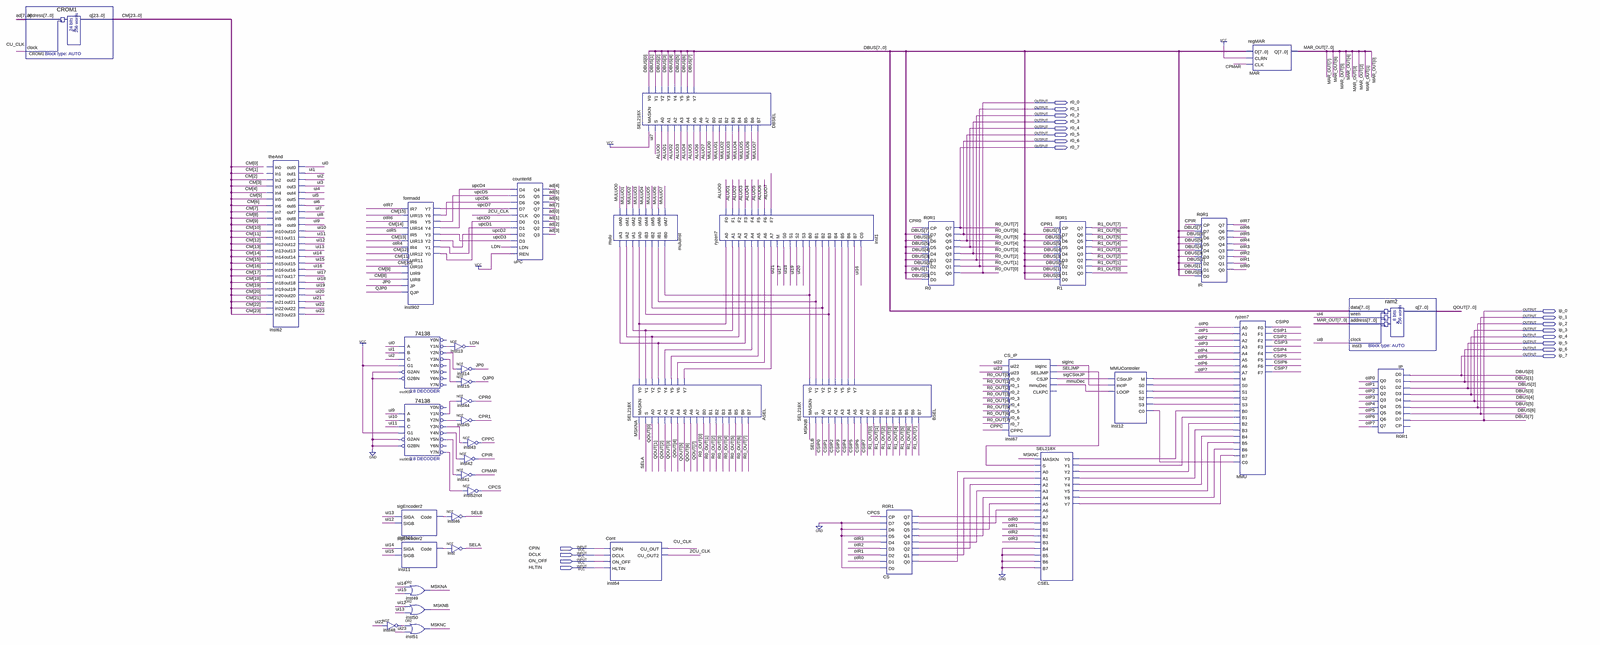
[diagram p0: schematic sheet, whole]
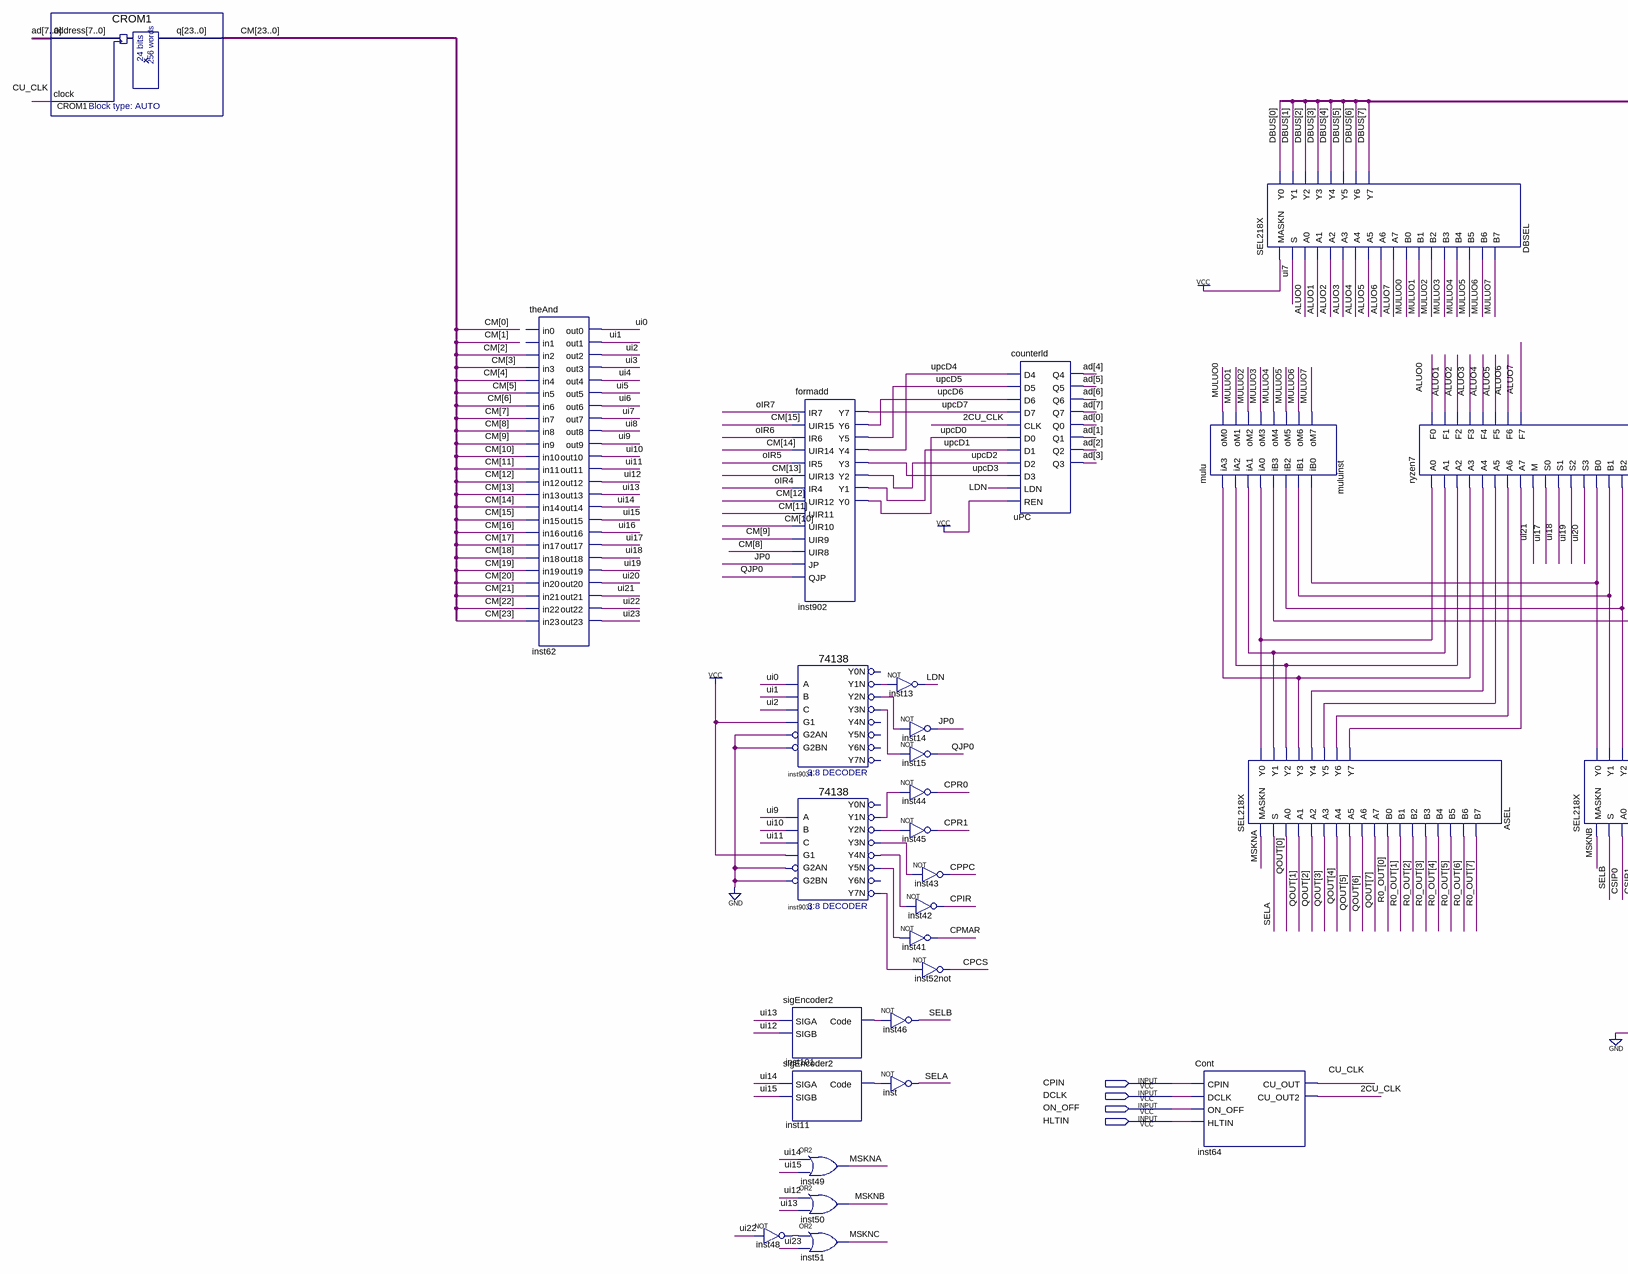
[diagram p1: schematic sheet, left part]
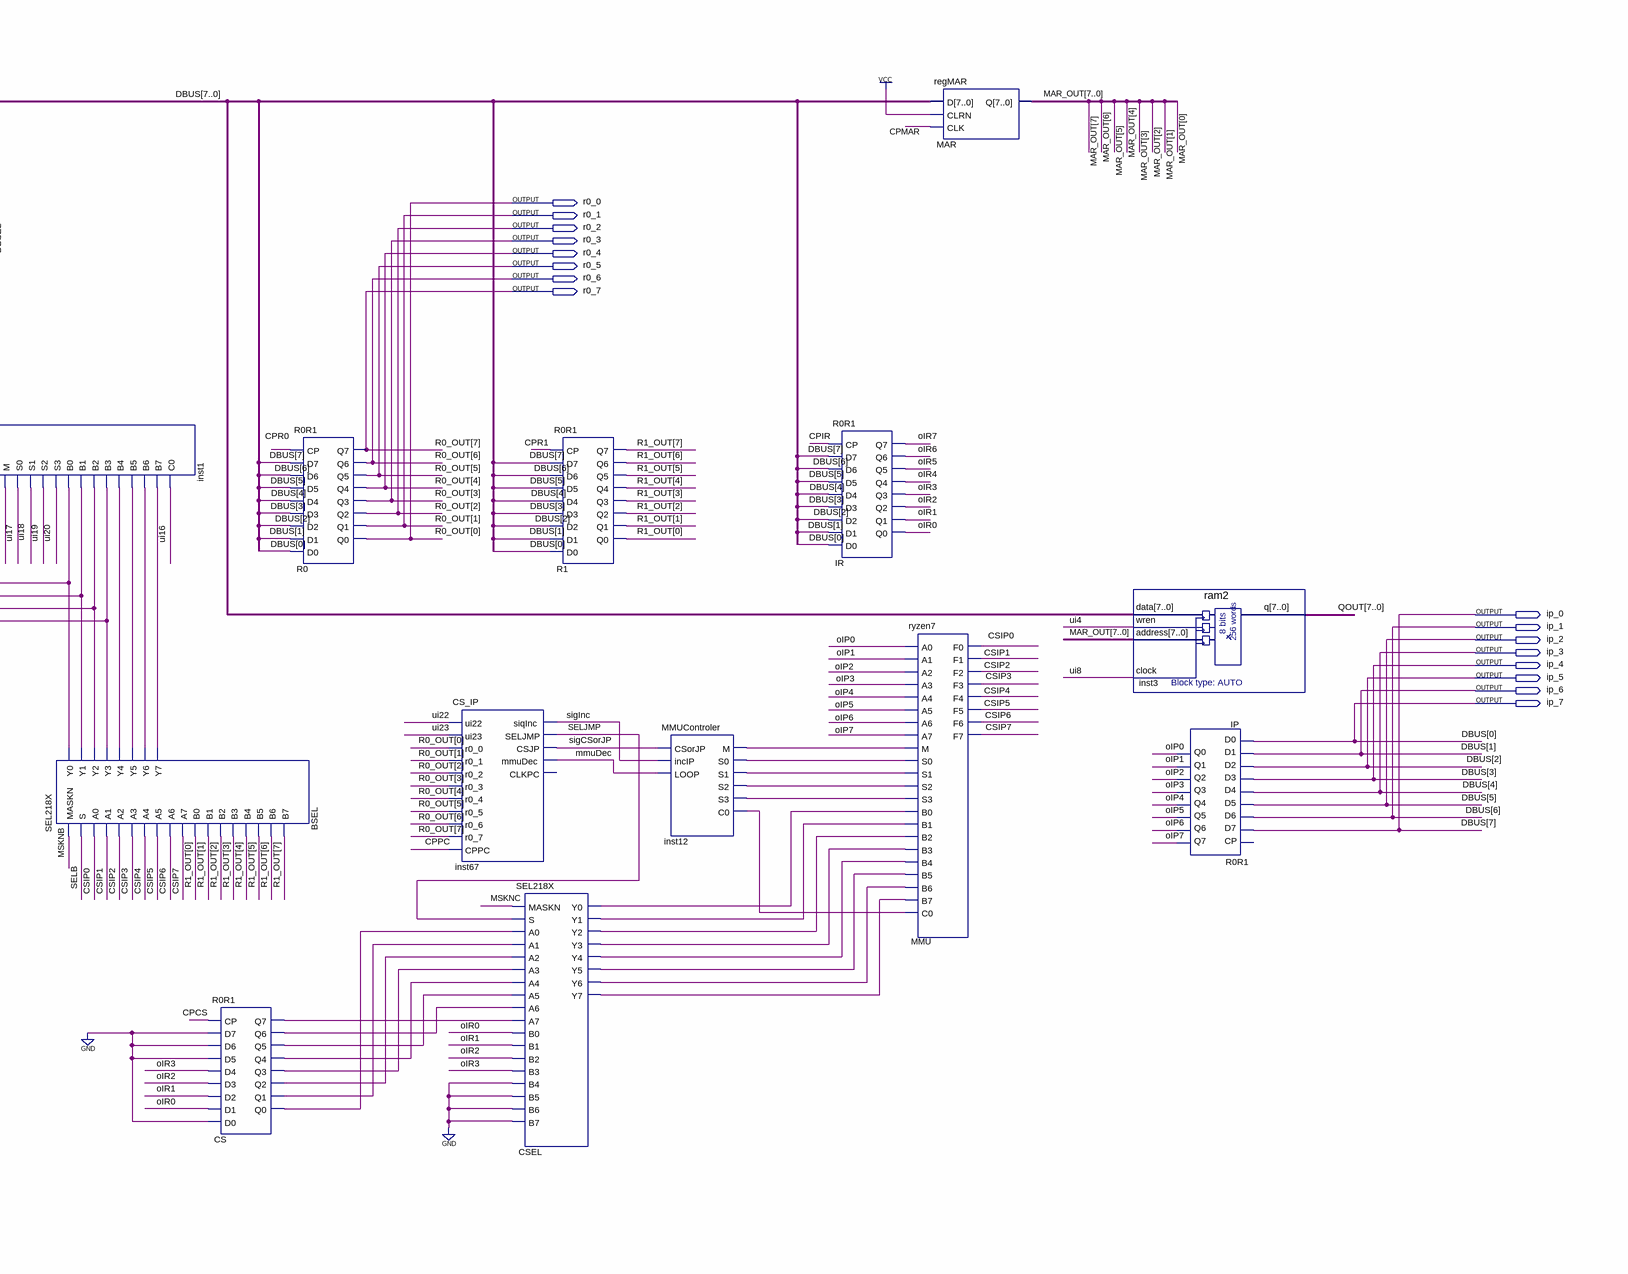
[diagram p2: schematic sheet, right part]
// Quartus schematic proj3_t1.bdf as structural Verilog: 40 symbols, 20 pins
module proj3_t1 (
  input  CPIN,
  input  DCLK,
  input  ON_OFF,
  input  HLTIN,
  output r0_0,
  output r0_1,
  output r0_2,
  output r0_3,
  output r0_4,
  output r0_5,
  output r0_6,
  output r0_7,
  output ip_0,
  output ip_1,
  output ip_2,
  output ip_3,
  output ip_4,
  output ip_5,
  output ip_6,
  output ip_7
);

  wire \2CU_CLK , ALUO0, ALUO1, ALUO2, ALUO3, ALUO4, ALUO5, ALUO6, ALUO7, ASEL_y0, ASEL_y1, ASEL_y2, ASEL_y3,
       ASEL_y4, ASEL_y5, ASEL_y6, ASEL_y7, BSEL_y0, BSEL_y1, BSEL_y2, BSEL_y3, BSEL_y4, BSEL_y5, BSEL_y6,
       BSEL_y7, CPCS, CPIR, CPMAR, CPPC, CPR0, CPR1, CS_q0, CS_q1, CS_q2, CS_q3, CS_q4, CS_q5, CS_q6, CS_q7,
       CSEL_y0, CSEL_y1, CSEL_y2, CSEL_y3, CSEL_y4, CSEL_y5, CSEL_y6, CSEL_y7, CSIP0, CSIP1, CSIP2, CSIP3,
       CSIP4, CSIP5, CSIP6, CSIP7, CU_CLK, inst11_code, inst12_c0, inst12_m, inst12_s0, inst12_s1, inst12_s2,
       inst12_s3, inst48_out, inst101_code, inst9031_y1n, inst9031_y2n, inst9031_y3n, inst9031_y4n,
       inst9031_y5n, inst9031_y7n, inst9034_y1n, inst9034_y2n, inst9034_y3n, JP0, LDN, mmuDec, MSKNA, MSKNB,
       MSKNC, MULUO0, MULUO1, MULUO2, MULUO3, MULUO4, MULUO5, MULUO6, MULUO7, oIP0, oIP1, oIP2, oIP3, oIP4,
       oIP5, oIP6, oIP7, oIR0, oIR1, oIR2, oIR3, oIR4, oIR5, oIR6, oIR7, QJP0, SELA, SELB, SELJMP, sigCSorJP,
       sigInc, ui0, ui1, ui2, ui3, ui4, ui5, ui6, ui7, ui8, ui9, ui10, ui11, ui12, ui13, ui14, ui15, ui16,
       ui17, ui18, ui19, ui20, ui21, ui22, ui23, upcD0, upcD1, upcD2, upcD3, upcD4, upcD5, upcD6, upcD7;
  wire [7:0] ad, MAR_OUT, QOUT, R1_OUT;
  wire [23:0] CM;

  CROM1 CROM1 (.address(ad), .clock(CU_CLK), .q(CM));
  theAnd inst62 (
    .in2(CM[2]), .in3(CM[3]), .in4(CM[4]), .in5(CM[5]), .in6(CM[6]), .in7(CM[7]), .in8(CM[8]), .in9(CM[9]),
    .in10(CM[10]), .in11(CM[11]), .in12(CM[12]), .in13(CM[13]), .in14(CM[14]), .in15(CM[15]), .in16(CM[16]),
    .in17(CM[17]), .in18(CM[18]), .in19(CM[19]), .in20(CM[20]), .in21(CM[21]), .in22(CM[22]), .in23(CM[23]),
    .out0(ui0), .out1(ui1), .out2(ui2), .out3(ui3), .out4(ui4), .out5(ui5), .out6(ui6), .out7(ui7),
    .out8(ui8), .out9(ui9), .out10(ui10), .out11(ui11), .out12(ui12), .out13(ui13), .out14(ui14),
    .out15(ui15), .out16(ui16), .out17(ui17), .out18(ui18), .out19(ui19), .out20(ui20), .out21(ui21),
    .out22(ui22), .out23(ui23));  // open: in0, in1
  not inst48 (inst48_out, ui22);
  formadd inst902 (
    .IR7(oIR7), .UIR15(CM[15]), .IR6(oIR6), .UIR14(CM[14]), .IR5(oIR5), .UIR13(CM[13]), .IR4(oIR4),
    .UIR12(CM[12]), .UIR11(CM[11]), .UIR10(CM[10]), .UIR9(CM[9]), .UIR8(CM[8]), .JP(JP0), .QJP(QJP0),
    .Y7(upcD7), .Y6(upcD6), .Y5(upcD5), .Y4(upcD4), .Y3(upcD3), .Y2(upcD2), .Y1(upcD1), .Y0(upcD0));
  \74138  inst9034 (
    .A(ui0), .B(ui1), .G1(1'b1), .C(ui2), .G2AN(1'b0), .G2BN(1'b0), .Y1N(inst9034_y1n), .Y2N(inst9034_y2n),
    .Y3N(inst9034_y3n));  // open: Y0N, Y4N, Y5N, Y6N, Y7N
  \74138  inst9031 (
    .A(ui9), .B(ui10), .G1(1'b1), .C(ui11), .G2AN(1'b0), .G2BN(1'b0), .Y1N(inst9031_y1n), .Y2N(inst9031_y2n),
    .Y3N(inst9031_y3n), .Y4N(inst9031_y4n), .Y5N(inst9031_y5n), .Y7N(inst9031_y7n));  // open: Y0N, Y6N
  sigEncoder2 inst101 (.SIGA(ui13), .SIGB(ui12), .Code(inst101_code));
  sigEncoder2 inst11 (.SIGA(ui14), .SIGB(ui15), .Code(inst11_code));
  or inst49 (MSKNA, ui14, ui15);
  or inst50 (MSKNB, ui12, ui13);
  or inst51 (MSKNC, inst48_out, ui23);
  not inst13 (LDN, inst9034_y1n);
  not inst14 (JP0, inst9034_y2n);
  not inst15 (QJP0, inst9034_y3n);
  not inst44 (CPR0, inst9031_y1n);
  not inst45 (CPR1, inst9031_y2n);
  not inst43 (CPPC, inst9031_y3n);
  not inst42 (CPIR, inst9031_y4n);
  not inst41 (CPMAR, inst9031_y5n);
  not inst52not (CPCS, inst9031_y7n);
  not inst46 (SELB, inst101_code);
  not inst (SELA, inst11_code);
  counterld uPC (
    .D4(upcD4), .D5(upcD5), .D6(upcD6), .D7(upcD7), .CLK(\2CU_CLK ), .D0(upcD0), .D1(upcD1), .D2(upcD2),
    .D3(upcD3), .LDN(LDN), .REN(1'b1), .Q4(ad[4]), .Q5(ad[5]), .Q6(ad[6]), .Q7(ad[7]), .Q0(ad[0]),
    .Q1(ad[1]), .Q2(ad[2]), .Q3(ad[3]));
  mulu muluinst (
    .iA3(ASEL_y3), .iA2(ASEL_y2), .iA1(ASEL_y1), .iA0(ASEL_y0), .iB3(BSEL_y3), .iB2(BSEL_y2), .iB1(BSEL_y1),
    .iB0(BSEL_y0), .oM0(MULUO0), .oM1(MULUO1), .oM2(MULUO2), .oM3(MULUO3), .oM4(MULUO4), .oM5(MULUO5),
    .oM6(MULUO6), .oM7(MULUO7));
  Cont inst64 (.CPIN(CPIN), .DCLK(DCLK), .ON_OFF(ON_OFF), .HLTIN(HLTIN), .CU_OUT(CU_CLK), .CU_OUT2(\2CU_CLK ));
  SEL218X DBSEL (
    .MASKN(1'b1), .S(ui7), .A0(ALUO0), .A1(ALUO1), .A2(ALUO2), .A3(ALUO3), .A4(ALUO4), .A5(ALUO5),
    .A6(ALUO6), .A7(ALUO7), .B0(MULUO0), .B1(MULUO1), .B2(MULUO2), .B3(MULUO3), .B4(MULUO4), .B5(MULUO5),
    .B6(MULUO6), .B7(MULUO7), .Y0(ip_7), .Y1(ip_6), .Y2(ip_5), .Y3(ip_4), .Y4(ip_3), .Y5(ip_2), .Y6(ip_1),
    .Y7(ip_0));
  SEL218X ASEL (
    .MASKN(MSKNA), .S(SELA), .A0(QOUT[0]), .A1(QOUT[1]), .A2(QOUT[2]), .A3(QOUT[3]), .A4(QOUT[4]),
    .A5(QOUT[5]), .A6(QOUT[6]), .A7(QOUT[7]), .B0(r0_0), .B1(r0_1), .B2(r0_2), .B3(r0_3), .B4(r0_4),
    .B5(r0_5), .B6(r0_6), .B7(r0_7), .Y0(ASEL_y0), .Y1(ASEL_y1), .Y2(ASEL_y2), .Y3(ASEL_y3), .Y4(ASEL_y4),
    .Y5(ASEL_y5), .Y6(ASEL_y6), .Y7(ASEL_y7));
  ryzen7 inst1 (
    .A0(ASEL_y0), .A1(ASEL_y1), .A2(ASEL_y2), .A3(ASEL_y3), .A4(ASEL_y4), .A5(ASEL_y5), .A6(ASEL_y6),
    .A7(ASEL_y7), .M(ui21), .S0(ui17), .S1(ui18), .S2(ui19), .S3(ui20), .B0(BSEL_y0), .B1(BSEL_y1),
    .B2(BSEL_y2), .B3(BSEL_y3), .B4(BSEL_y4), .B5(BSEL_y5), .B6(BSEL_y6), .B7(BSEL_y7), .C0(ui16),
    .F0(ALUO0), .F1(ALUO1), .F2(ALUO2), .F3(ALUO3), .F4(ALUO4), .F5(ALUO5), .F6(ALUO6), .F7(ALUO7));
  SEL218X BSEL (
    .MASKN(MSKNB), .S(SELB), .A0(CSIP0), .A1(CSIP1), .A2(CSIP2), .A3(CSIP3), .A4(CSIP4), .A5(CSIP5),
    .A6(CSIP6), .A7(CSIP7), .B0(R1_OUT[0]), .B1(R1_OUT[1]), .B2(R1_OUT[2]), .B3(R1_OUT[3]), .B4(R1_OUT[4]),
    .B5(R1_OUT[5]), .B6(R1_OUT[6]), .B7(R1_OUT[7]), .Y0(BSEL_y0), .Y1(BSEL_y1), .Y2(BSEL_y2), .Y3(BSEL_y3),
    .Y4(BSEL_y4), .Y5(BSEL_y5), .Y6(BSEL_y6), .Y7(BSEL_y7));
  R0R1 CS (
    .CP(CPCS), .D7(1'b0), .D6(1'b0), .D5(1'b0), .D4(oIR3), .D3(oIR2), .D2(oIR1), .D1(oIR0), .D0(1'b0),
    .Q7(CS_q7), .Q6(CS_q6), .Q5(CS_q5), .Q4(CS_q4), .Q3(CS_q3), .Q2(CS_q2), .Q1(CS_q1), .Q0(CS_q0));
  R0R1 R0 (
    .CP(CPR0), .D7(ip_0), .D6(ip_1), .D5(ip_2), .D4(ip_3), .D3(ip_4), .D2(ip_5), .D1(ip_6), .D0(ip_7),
    .Q7(r0_7), .Q6(r0_6), .Q5(r0_5), .Q4(r0_4), .Q3(r0_3), .Q2(r0_2), .Q1(r0_1), .Q0(r0_0));
  CS_IP inst67 (
    .ui22(ui22), .ui23(ui23), .r0_0(r0_0), .r0_1(r0_1), .r0_2(r0_2), .r0_3(r0_3), .r0_4(r0_4), .r0_5(r0_5),
    .r0_6(r0_6), .r0_7(r0_7), .CPPC(CPPC), .siqInc(sigInc), .SELJMP(SELJMP), .CSJP(sigCSorJP), .mmuDec(mmuDec));  // open: CLKPC
  R0R1 R1 (
    .CP(CPR1), .D7(ip_0), .D6(ip_1), .D5(ip_2), .D4(ip_3), .D3(ip_4), .D2(ip_5), .D1(ip_6), .D0(ip_7),
    .Q7(R1_OUT[7]), .Q6(R1_OUT[6]), .Q5(R1_OUT[5]), .Q4(R1_OUT[4]), .Q3(R1_OUT[3]), .Q2(R1_OUT[2]),
    .Q1(R1_OUT[1]), .Q0(R1_OUT[0]));
  SEL218X CSEL (
    .MASKN(MSKNC), .S(SELJMP), .A0(CS_q0), .A1(CS_q1), .A2(CS_q2), .A3(CS_q3), .A4(CS_q4), .A5(CS_q5),
    .A6(CS_q6), .A7(CS_q7), .B0(oIR0), .B1(oIR1), .B2(oIR2), .B3(oIR3), .B4(1'b0), .B5(1'b0), .B6(1'b0),
    .B7(1'b0), .Y0(CSEL_y0), .Y1(CSEL_y1), .Y2(CSEL_y2), .Y3(CSEL_y3), .Y4(CSEL_y4), .Y5(CSEL_y5),
    .Y6(CSEL_y6), .Y7(CSEL_y7));
  MMUControler inst12 (
    .CSorJP(sigCSorJP), .incIP(sigInc), .LOOP(mmuDec), .M(inst12_m), .S0(inst12_s0), .S1(inst12_s1),
    .S2(inst12_s2), .S3(inst12_s3), .C0(inst12_c0));
  R0R1 IR (
    .CP(CPIR), .D7(ip_0), .D6(ip_1), .D5(ip_2), .D4(ip_3), .D3(ip_4), .D2(ip_5), .D1(ip_6), .D0(ip_7),
    .Q7(oIR7), .Q6(oIR6), .Q5(oIR5), .Q4(oIR4), .Q3(oIR3), .Q2(oIR2), .Q1(oIR1), .Q0(oIR0));
  ryzen7 MMU (
    .A0(oIP0), .A1(oIP1), .A2(oIP2), .A3(oIP3), .A4(oIP4), .A5(oIP5), .A6(oIP6), .A7(oIP7), .M(inst12_m),
    .S0(inst12_s0), .S1(inst12_s1), .S2(inst12_s2), .S3(inst12_s3), .B0(CSEL_y0), .B1(CSEL_y1), .B2(CSEL_y2),
    .B3(CSEL_y3), .B4(CSEL_y4), .B5(CSEL_y5), .B6(CSEL_y6), .B7(CSEL_y7), .C0(inst12_c0), .F0(CSIP0),
    .F1(CSIP1), .F2(CSIP2), .F3(CSIP3), .F4(CSIP4), .F5(CSIP5), .F6(CSIP6), .F7(CSIP7));
  regMAR MAR (.D({ip_0, ip_1, ip_2, ip_3, ip_4, ip_5, ip_6, ip_7}), .CLRN(1'b1), .CLK(CPMAR), .Q(MAR_OUT));
  ram2 inst3 (
    .data({ip_0, ip_1, ip_2, ip_3, ip_4, ip_5, ip_6, ip_7}), .wren(ui4), .address(MAR_OUT), .clock(ui8),
    .q(QOUT));
  R0R1 IP (
    .D7(ip_0), .D6(ip_1), .D5(ip_2), .D4(ip_3), .D3(ip_4), .D2(ip_5), .D1(ip_6), .D0(ip_7), .Q7(oIP7),
    .Q6(oIP6), .Q5(oIP5), .Q4(oIP4), .Q3(oIP3), .Q2(oIP2), .Q1(oIP1), .Q0(oIP0));  // open: CP

  // Other names for the same wires on the sheet: DBUS[7:0] = {ip_0, ip_1, ip_2, ip_3, ip_4, ip_5, ip_6, ip_7};
  //   R0_OUT[7:0] = {r0_7, r0_6, r0_5, r0_4, r0_3, r0_2, r0_1, r0_0}
endmodule
